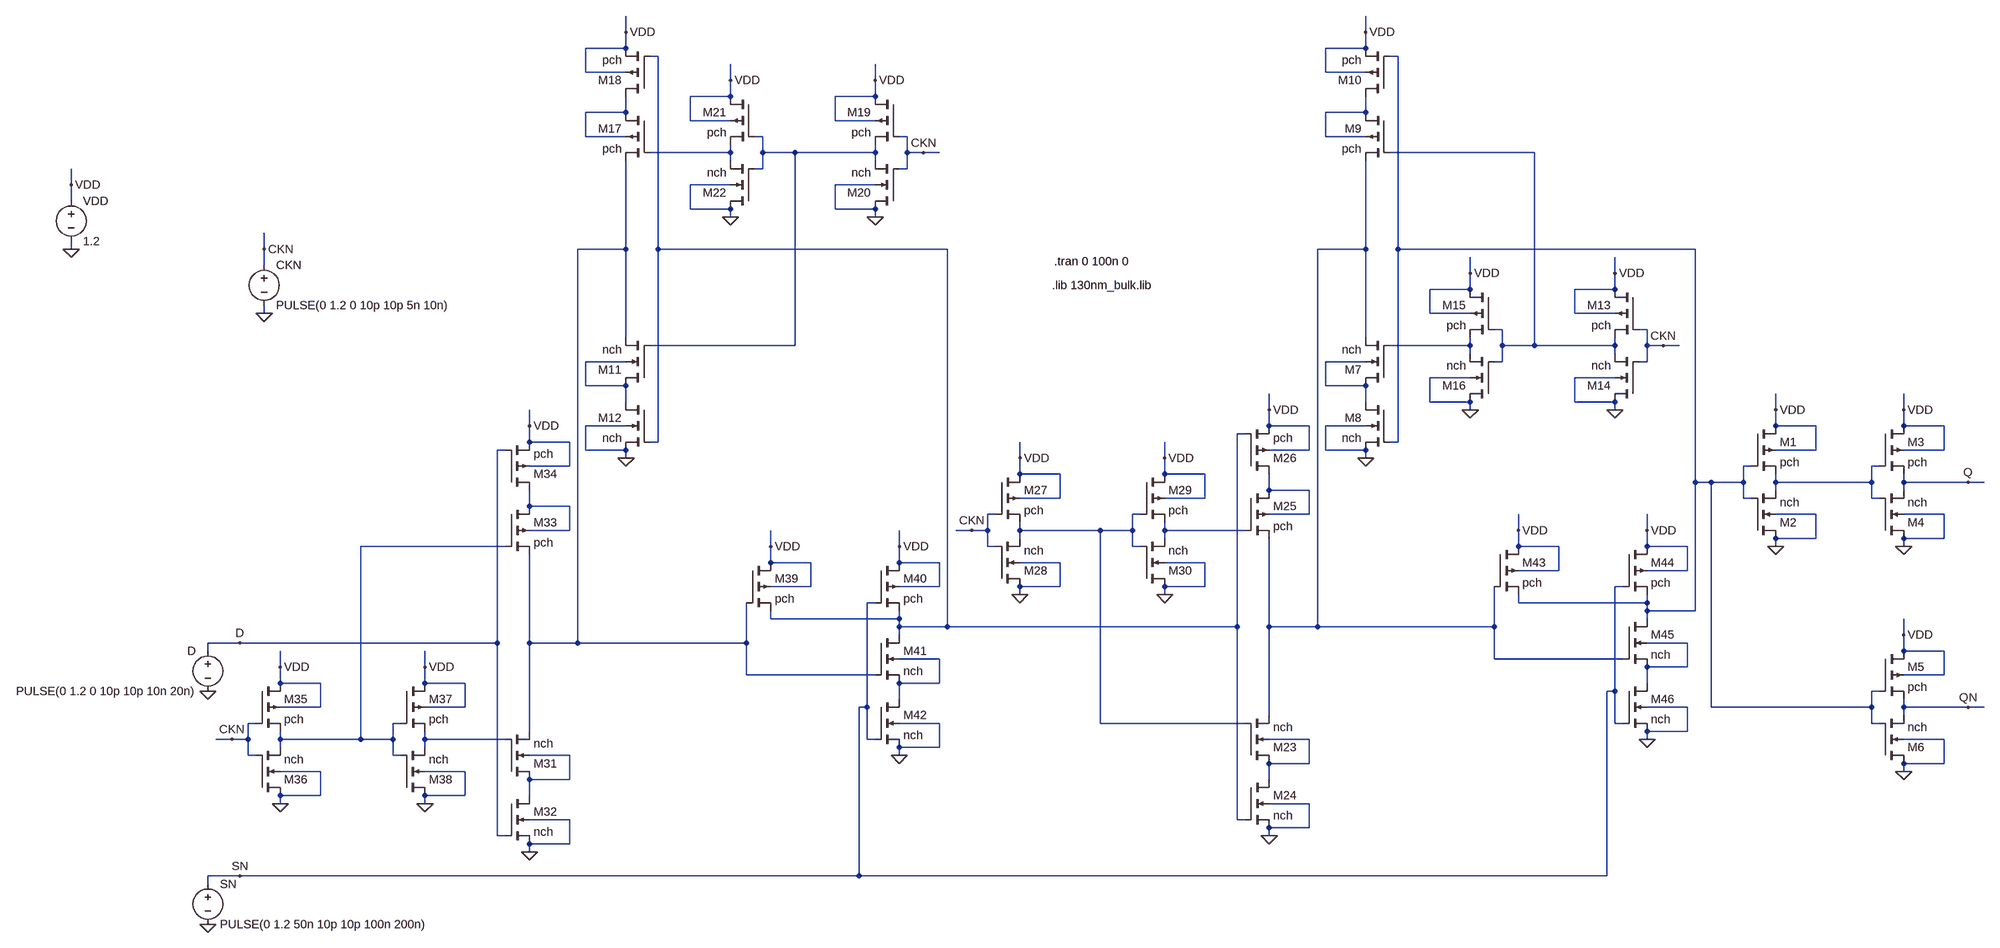
[diagram p0: schematic D_FLIPFLOP_With_Asynchronous_Set_in_130nm_Technology.asc]
D_FLIPFLOP_With_Asynchronous_Set_in_130nm_Technology.asc, the LTspice schematic file:
Version 4
SHEET 1 880 2004
WIRE -1952 -752 -1952 -784
WIRE -480 -752 -480 -784
WIRE -1952 -720 -1952 -752
WIRE -1952 -720 -2032 -720
WIRE -480 -720 -480 -752
WIRE -480 -720 -560 -720
WIRE -1888 -704 -1904 -704
WIRE -416 -704 -432 -704
WIRE -2032 -672 -2032 -720
WIRE -1952 -672 -2032 -672
WIRE -560 -672 -560 -720
WIRE -480 -672 -560 -672
WIRE -1744 -656 -1744 -688
WIRE -1456 -656 -1456 -688
WIRE -1744 -624 -1744 -656
WIRE -1744 -624 -1824 -624
WIRE -1456 -624 -1456 -656
WIRE -1456 -624 -1536 -624
WIRE -1952 -592 -1952 -624
WIRE -1952 -592 -2032 -592
WIRE -480 -592 -480 -624
WIRE -480 -592 -560 -592
WIRE -1824 -576 -1824 -624
WIRE -1744 -576 -1824 -576
WIRE -1536 -576 -1536 -624
WIRE -1456 -576 -1536 -576
WIRE -2032 -544 -2032 -592
WIRE -1952 -544 -2032 -544
WIRE -1680 -544 -1696 -544
WIRE -1392 -544 -1408 -544
WIRE -560 -544 -560 -592
WIRE -480 -544 -560 -544
WIRE -1744 -512 -1744 -528
WIRE -1744 -512 -1904 -512
WIRE -1680 -512 -1680 -544
WIRE -1616 -512 -1680 -512
WIRE -1456 -512 -1456 -528
WIRE -1456 -512 -1616 -512
WIRE -1392 -512 -1392 -544
WIRE -1360 -512 -1392 -512
WIRE -1328 -512 -1360 -512
WIRE -144 -512 -432 -512
WIRE -1744 -496 -1744 -512
WIRE -1456 -496 -1456 -512
WIRE -1680 -480 -1680 -512
WIRE -1680 -480 -1696 -480
WIRE -1392 -480 -1392 -512
WIRE -1392 -480 -1408 -480
WIRE -3056 -448 -3056 -480
WIRE -1744 -448 -1824 -448
WIRE -1456 -448 -1536 -448
WIRE -3056 -416 -3056 -448
WIRE -1824 -400 -1824 -448
WIRE -1744 -400 -1824 -400
WIRE -1536 -400 -1536 -448
WIRE -1456 -400 -1536 -400
WIRE -1744 -384 -1744 -400
WIRE -1456 -384 -1456 -400
WIRE -3056 -320 -3056 -336
WIRE -2672 -320 -2672 -352
WIRE -1952 -320 -1952 -496
WIRE -1952 -320 -2048 -320
WIRE -1888 -320 -1888 -704
WIRE -1312 -320 -1888 -320
WIRE -480 -320 -480 -496
WIRE -480 -320 -576 -320
WIRE -416 -320 -416 -704
WIRE 176 -320 -416 -320
WIRE -2672 -288 -2672 -320
WIRE -272 -272 -272 -304
WIRE 16 -272 16 -304
WIRE -272 -240 -272 -272
WIRE -272 -240 -352 -240
WIRE 16 -240 16 -272
WIRE 16 -240 -64 -240
WIRE -2672 -192 -2672 -208
WIRE -352 -192 -352 -240
WIRE -272 -192 -352 -192
WIRE -64 -192 -64 -240
WIRE 16 -192 -64 -192
WIRE -208 -160 -224 -160
WIRE 80 -160 64 -160
WIRE -1952 -144 -1952 -320
WIRE -480 -144 -480 -320
WIRE -1616 -128 -1616 -512
WIRE -1616 -128 -1904 -128
WIRE -272 -128 -272 -144
WIRE -272 -128 -432 -128
WIRE -208 -128 -208 -160
WIRE -144 -128 -144 -512
WIRE -144 -128 -208 -128
WIRE 16 -128 16 -144
WIRE 16 -128 -144 -128
WIRE 80 -128 80 -160
WIRE 112 -128 80 -128
WIRE 144 -128 112 -128
WIRE -272 -112 -272 -128
WIRE 16 -112 16 -128
WIRE -1952 -96 -2032 -96
WIRE -480 -96 -560 -96
WIRE -208 -96 -208 -128
WIRE -208 -96 -224 -96
WIRE 80 -96 80 -128
WIRE 80 -96 64 -96
WIRE -272 -64 -352 -64
WIRE 16 -64 -64 -64
WIRE -2032 -48 -2032 -96
WIRE -1952 -48 -2032 -48
WIRE -560 -48 -560 -96
WIRE -480 -48 -560 -48
WIRE -1952 -16 -1952 -48
WIRE -480 -16 -480 -48
WIRE -352 -16 -352 -64
WIRE -272 -16 -352 -16
WIRE -64 -16 -64 -64
WIRE 16 -16 -64 -16
WIRE -672 0 -672 -32
WIRE -272 0 -272 -16
WIRE 16 0 16 -16
WIRE 336 0 336 -32
WIRE 624 0 624 -32
WIRE -2144 32 -2144 0
WIRE -1952 32 -2032 32
WIRE -672 32 -672 0
WIRE -592 32 -672 32
WIRE -480 32 -560 32
WIRE 336 32 336 0
WIRE 416 32 336 32
WIRE 624 32 624 0
WIRE 704 32 624 32
WIRE -720 48 -736 48
WIRE -2144 64 -2144 32
WIRE -2064 64 -2144 64
WIRE -1888 64 -1888 -320
WIRE -1888 64 -1904 64
WIRE -416 64 -416 -320
WIRE -416 64 -432 64
WIRE -2192 80 -2208 80
WIRE -2032 80 -2032 32
WIRE -1952 80 -2032 80
WIRE -592 80 -592 32
WIRE -592 80 -672 80
WIRE -560 80 -560 32
WIRE -480 80 -560 80
WIRE 416 80 416 32
WIRE 416 80 336 80
WIRE 704 80 704 32
WIRE 704 80 624 80
WIRE -1952 96 -1952 80
WIRE -1168 96 -1168 64
WIRE -880 96 -880 64
WIRE -480 96 -480 80
WIRE -2064 112 -2064 64
WIRE -2064 112 -2144 112
WIRE 288 112 272 112
WIRE 576 112 560 112
WIRE -1168 128 -1168 96
WIRE -1088 128 -1168 128
WIRE -880 128 -880 96
WIRE -800 128 -880 128
WIRE 176 144 176 -320
WIRE 208 144 176 144
WIRE 272 144 272 112
WIRE 272 144 208 144
WIRE 336 144 336 128
WIRE 560 144 560 112
WIRE 560 144 336 144
WIRE 624 144 624 128
WIRE 752 144 624 144
WIRE 784 144 752 144
WIRE -672 160 -672 128
WIRE -592 160 -672 160
WIRE 336 160 336 144
WIRE 624 160 624 144
WIRE -1088 176 -1088 128
WIRE -1088 176 -1168 176
WIRE -800 176 -800 128
WIRE -800 176 -880 176
WIRE 272 176 272 144
WIRE 288 176 272 176
WIRE 560 176 560 144
WIRE 576 176 560 176
WIRE -2144 192 -2144 160
WIRE -2064 192 -2144 192
WIRE -1216 208 -1232 208
WIRE -928 208 -944 208
WIRE -592 208 -592 160
WIRE -592 208 -672 208
WIRE 416 208 336 208
WIRE 704 208 624 208
WIRE -2064 240 -2064 192
WIRE -2064 240 -2144 240
WIRE -1264 240 -1296 240
WIRE -1232 240 -1232 208
WIRE -1232 240 -1264 240
WIRE -1168 240 -1168 224
WIRE -1008 240 -1168 240
WIRE -944 240 -944 208
WIRE -944 240 -1008 240
WIRE -880 240 -880 224
WIRE -720 240 -880 240
WIRE -176 240 -176 208
WIRE 80 240 80 208
WIRE -1168 256 -1168 240
WIRE -880 256 -880 240
WIRE 416 256 416 208
WIRE 416 256 336 256
WIRE 704 256 704 208
WIRE 704 256 624 256
WIRE -2192 272 -2480 272
WIRE -1664 272 -1664 240
WIRE -1408 272 -1408 240
WIRE -1232 272 -1232 240
WIRE -1216 272 -1232 272
WIRE -944 272 -944 240
WIRE -928 272 -944 272
WIRE -176 272 -176 240
WIRE -96 272 -176 272
WIRE 80 272 80 240
WIRE 160 272 80 272
WIRE 336 272 336 256
WIRE 624 272 624 256
WIRE -1664 304 -1664 272
WIRE -1584 304 -1664 304
WIRE -1408 304 -1408 272
WIRE -1328 304 -1408 304
WIRE -1088 304 -1168 304
WIRE -800 304 -880 304
WIRE -96 320 -96 272
WIRE -96 320 -176 320
WIRE 160 320 160 272
WIRE 160 320 80 320
WIRE -1584 352 -1584 304
WIRE -1584 352 -1664 352
WIRE -1328 352 -1328 304
WIRE -1328 352 -1408 352
WIRE -1088 352 -1088 304
WIRE -1088 352 -1168 352
WIRE -800 352 -800 304
WIRE -800 352 -880 352
WIRE 32 352 16 352
WIRE -1168 368 -1168 352
WIRE -880 368 -880 352
WIRE -1456 384 -1472 384
WIRE -176 384 -176 368
WIRE 80 384 80 368
WIRE 80 384 -176 384
WIRE 80 400 80 384
WIRE 176 400 176 144
WIRE 176 400 80 400
WIRE -1664 416 -1664 400
WIRE -1408 416 -1408 400
WIRE -1408 416 -1664 416
WIRE 80 416 80 400
WIRE -1408 432 -1408 416
WIRE -1312 432 -1312 -320
WIRE -1312 432 -1408 432
WIRE -736 432 -736 48
WIRE -736 432 -1312 432
WIRE -672 432 -672 256
WIRE -576 432 -576 -320
WIRE -576 432 -672 432
WIRE -224 432 -224 352
WIRE -224 432 -576 432
WIRE -1408 448 -1408 432
WIRE 624 448 624 416
WIRE -2720 464 -2784 464
WIRE -2208 464 -2208 80
WIRE -2208 464 -2720 464
WIRE -2144 464 -2144 288
WIRE -2048 464 -2048 -320
WIRE -2048 464 -2144 464
WIRE -1712 464 -1712 384
WIRE -1712 464 -2048 464
WIRE 160 464 80 464
WIRE -2784 480 -2784 464
WIRE 624 480 624 448
WIRE 704 480 624 480
WIRE -1328 496 -1408 496
WIRE -224 496 -224 432
WIRE 32 496 -224 496
WIRE -2640 512 -2640 480
WIRE -2352 512 -2352 480
WIRE 160 512 160 464
WIRE 160 512 80 512
WIRE -1712 528 -1712 464
WIRE -1456 528 -1712 528
WIRE 704 528 704 480
WIRE 704 528 624 528
WIRE -2640 544 -2640 512
WIRE -2560 544 -2640 544
WIRE -2352 544 -2352 512
WIRE -2272 544 -2352 544
WIRE -1328 544 -1328 496
WIRE -1328 544 -1408 544
WIRE 80 544 80 512
WIRE 16 560 16 352
WIRE 16 560 0 560
WIRE 576 560 560 560
WIRE -1408 576 -1408 544
WIRE -2560 592 -2560 544
WIRE -2560 592 -2640 592
WIRE -2272 592 -2272 544
WIRE -2272 592 -2352 592
WIRE -1472 592 -1472 384
WIRE -1472 592 -1488 592
WIRE 160 592 80 592
WIRE 208 592 208 144
WIRE 560 592 560 560
WIRE 560 592 208 592
WIRE 624 592 624 576
WIRE 752 592 624 592
WIRE 784 592 752 592
WIRE -672 608 -672 432
WIRE 624 608 624 592
WIRE -2688 624 -2704 624
WIRE -2400 624 -2416 624
WIRE -1328 624 -1408 624
WIRE -1008 624 -1008 240
WIRE -720 624 -1008 624
WIRE 16 624 16 560
WIRE 32 624 16 624
WIRE 560 624 560 592
WIRE 576 624 560 624
WIRE -2144 640 -2144 464
WIRE 160 640 160 592
WIRE 160 640 80 640
WIRE -2736 656 -2768 656
WIRE -2704 656 -2704 624
WIRE -2704 656 -2736 656
WIRE -2640 656 -2640 640
WIRE -2480 656 -2480 272
WIRE -2480 656 -2640 656
WIRE -2416 656 -2416 624
WIRE -2416 656 -2480 656
WIRE -2352 656 -2352 640
WIRE -2192 656 -2352 656
WIRE -1472 656 -1472 592
WIRE -1456 656 -1472 656
WIRE -592 656 -672 656
WIRE 80 656 80 640
WIRE 704 656 624 656
WIRE -2640 672 -2640 656
WIRE -2352 672 -2352 656
WIRE -1328 672 -1328 624
WIRE -1328 672 -1408 672
WIRE -2704 688 -2704 656
WIRE -2688 688 -2704 688
WIRE -2416 688 -2416 656
WIRE -2400 688 -2416 688
WIRE -2064 688 -2144 688
WIRE -1408 688 -1408 672
WIRE -592 704 -592 656
WIRE -592 704 -672 704
WIRE 704 704 704 656
WIRE 704 704 624 704
WIRE -2560 720 -2640 720
WIRE -2272 720 -2352 720
WIRE 624 720 624 704
WIRE -2064 736 -2064 688
WIRE -2064 736 -2144 736
WIRE -672 736 -672 704
WIRE -2560 768 -2560 720
WIRE -2560 768 -2640 768
WIRE -2272 768 -2272 720
WIRE -2272 768 -2352 768
WIRE -2144 768 -2144 736
WIRE -2640 784 -2640 768
WIRE -2352 784 -2352 768
WIRE -592 784 -672 784
WIRE -2064 816 -2144 816
WIRE -736 816 -736 432
WIRE -720 816 -736 816
WIRE -592 832 -592 784
WIRE -592 832 -672 832
WIRE -2208 848 -2208 464
WIRE -2192 848 -2208 848
WIRE -672 848 -672 832
WIRE -2064 864 -2064 816
WIRE -2064 864 -2144 864
WIRE -2144 880 -2144 864
WIRE -2720 928 -2784 928
WIRE -1488 928 -1488 592
WIRE -1488 928 -2720 928
WIRE 0 928 0 560
WIRE 0 928 -1488 928
WIRE -2784 944 -2784 928
FLAG -2640 784 0
FLAG -2352 784 0
FLAG -1408 688 0
FLAG -2144 32 VDD
FLAG -2736 656 CKN
FLAG -1168 368 0
FLAG -880 368 0
FLAG -672 0 VDD
FLAG -1264 240 CKN
FLAG -1168 96 VDD
FLAG -880 96 VDD
FLAG -1456 -384 0
FLAG -1744 -384 0
FLAG -1952 -752 VDD
FLAG -1360 -512 CKN
FLAG -1456 -656 VDD
FLAG -1744 -656 VDD
FLAG 16 0 0
FLAG -272 0 0
FLAG -480 -752 VDD
FLAG 112 -128 CKN
FLAG 80 656 0
FLAG -2144 880 0
FLAG -1952 96 0
FLAG -672 848 0
FLAG -480 96 0
FLAG 336 272 0
FLAG 624 272 0
FLAG 624 720 0
FLAG -2352 512 VDD
FLAG -2640 512 VDD
FLAG -1664 272 VDD
FLAG -1408 272 VDD
FLAG -272 -272 VDD
FLAG 16 -272 VDD
FLAG -176 240 VDD
FLAG 80 240 VDD
FLAG 336 0 VDD
FLAG 624 0 VDD
FLAG 624 448 VDD
FLAG -2720 464 D
FLAG -2720 928 SN
FLAG 752 144 Q
FLAG 752 592 QN
FLAG -3056 -320 0
FLAG -3056 -448 VDD
FLAG -2784 560 0
FLAG -2784 1024 0
FLAG -2672 -192 0
FLAG -2672 -320 CKN
SYMBOL pmos4 288 32 R0
SYMATTR InstName M1
SYMATTR Value pch
SYMATTR Value2 l=0.13u w=0.8u
SYMBOL nmos4 288 256 M180
SYMATTR InstName M2
SYMATTR Value nch
SYMATTR Value2 l=0.13u w=0.4u
SYMBOL pmos4 576 32 R0
SYMATTR InstName M3
SYMATTR Value pch
SYMATTR Value2 l=0.13u w=0.8u
SYMBOL nmos4 576 256 M180
SYMATTR InstName M4
SYMATTR Value nch
SYMATTR Value2 l=0.13u w=0.4u
SYMBOL pmos4 576 480 R0
SYMATTR InstName M5
SYMATTR Value pch
SYMATTR Value2 l=0.13u w=0.8u
SYMBOL nmos4 576 704 M180
SYMATTR InstName M6
SYMATTR Value nch
SYMATTR Value2 l=0.13u w=0.4u
SYMBOL nmos4 -2192 736 M180
SYMATTR InstName M31
SYMATTR Value nch
SYMATTR Value2 l=0.13u w=0.4u
SYMBOL nmos4 -2192 768 R0
SYMATTR InstName M32
SYMATTR Value nch
SYMATTR Value2 l=0.13u w=0.4u
SYMBOL pmos4 -2192 192 R0
SYMATTR InstName M33
SYMATTR Value pch
SYMATTR Value2 l=0.13u w=0.8u
SYMBOL pmos4 -2192 160 M180
SYMATTR InstName M34
SYMATTR Value pch
SYMATTR Value2 l=0.13u w=0.8u
SYMBOL pmos4 -2688 544 R0
SYMATTR InstName M35
SYMATTR Value pch
SYMATTR Value2 l=0.13u w=0.8u
SYMBOL nmos4 -2688 768 M180
SYMATTR InstName M36
SYMATTR Value nch
SYMATTR Value2 l=0.13u w=0.4u
SYMBOL pmos4 -2400 544 R0
SYMATTR InstName M37
SYMATTR Value pch
SYMATTR Value2 l=0.13u w=0.8u
SYMBOL nmos4 -2400 768 M180
SYMATTR InstName M38
SYMATTR Value nch
SYMATTR Value2 l=0.13u w=0.4u
SYMBOL pmos4 -1712 304 R0
SYMATTR InstName M39
SYMATTR Value pch
SYMATTR Value2 l=0.13u w=0.8u
SYMBOL pmos4 -1456 304 R0
SYMATTR InstName M40
SYMATTR Value pch
SYMATTR Value2 l=0.13u w=0.8u
SYMBOL nmos4 -1456 448 R0
SYMATTR InstName M41
SYMATTR Value nch
SYMATTR Value2 l=0.13u w=0.8u
SYMBOL nmos4 -1456 576 R0
SYMATTR InstName M42
SYMATTR Value nch
SYMATTR Value2 l=0.13u w=0.8u
SYMBOL pmos4 -224 272 R0
SYMATTR InstName M43
SYMATTR Value pch
SYMATTR Value2 l=0.13u w=0.8u
SYMBOL pmos4 32 272 R0
SYMATTR InstName M44
SYMATTR Value pch
SYMATTR Value2 l=0.13u w=0.8u
SYMBOL nmos4 32 416 R0
SYMATTR InstName M45
SYMATTR Value nch
SYMATTR Value2 l=0.13u w=0.8u
SYMBOL nmos4 32 544 R0
SYMATTR InstName M46
SYMATTR Value nch
SYMATTR Value2 l=0.13u w=0.8u
SYMBOL nmos4 -720 704 M180
SYMATTR InstName M23
SYMATTR Value nch
SYMATTR Value2 l=0.13u w=0.4u
SYMBOL nmos4 -720 736 R0
SYMATTR InstName M24
SYMATTR Value nch
SYMATTR Value2 l=0.13u w=0.4u
SYMBOL pmos4 -720 160 R0
SYMATTR InstName M25
SYMATTR Value pch
SYMATTR Value2 l=0.13u w=0.8u
SYMBOL pmos4 -720 128 M180
SYMATTR InstName M26
SYMATTR Value pch
SYMATTR Value2 l=0.13u w=0.8u
SYMBOL pmos4 -1216 128 R0
SYMATTR InstName M27
SYMATTR Value pch
SYMATTR Value2 l=0.13u w=0.8u
SYMBOL nmos4 -1216 352 M180
SYMATTR InstName M28
SYMATTR Value nch
SYMATTR Value2 l=0.13u w=0.4u
SYMBOL pmos4 -928 128 R0
SYMATTR InstName M29
SYMATTR Value pch
SYMATTR Value2 l=0.13u w=0.8u
SYMBOL nmos4 -928 352 M180
SYMATTR InstName M30
SYMATTR Value nch
SYMATTR Value2 l=0.13u w=0.4u
SYMBOL nmos4 -1904 -48 R180
SYMATTR InstName M11
SYMATTR Value nch
SYMATTR Value2 l=0.13u w=0.4u
SYMBOL nmos4 -1904 -16 M0
SYMATTR InstName M12
SYMATTR Value nch
SYMATTR Value2 l=0.13u w=0.4u
SYMBOL pmos4 -1904 -592 M0
SYMATTR InstName M17
SYMATTR Value pch
SYMATTR Value2 l=0.13u w=0.8u
SYMBOL pmos4 -1904 -624 R180
SYMATTR InstName M18
SYMATTR Value pch
SYMATTR Value2 l=0.13u w=0.8u
SYMBOL pmos4 -1408 -624 M0
SYMATTR InstName M19
SYMATTR Value pch
SYMATTR Value2 l=0.13u w=0.8u
SYMBOL nmos4 -1408 -400 R180
SYMATTR InstName M20
SYMATTR Value nch
SYMATTR Value2 l=0.13u w=0.4u
SYMBOL pmos4 -1696 -624 M0
SYMATTR InstName M21
SYMATTR Value pch
SYMATTR Value2 l=0.13u w=0.8u
SYMBOL nmos4 -1696 -400 R180
SYMATTR InstName M22
SYMATTR Value nch
SYMATTR Value2 l=0.13u w=0.4u
SYMBOL nmos4 -432 -48 R180
SYMATTR InstName M7
SYMATTR Value nch
SYMATTR Value2 l=0.13u w=0.4u
SYMBOL nmos4 -432 -16 M0
SYMATTR InstName M8
SYMATTR Value nch
SYMATTR Value2 l=0.13u w=0.4u
SYMBOL pmos4 -432 -592 M0
SYMATTR InstName M9
SYMATTR Value pch
SYMATTR Value2 l=0.13u w=0.8u
SYMBOL pmos4 -432 -624 R180
SYMATTR InstName M10
SYMATTR Value pch
SYMATTR Value2 l=0.13u w=0.8u
SYMBOL pmos4 64 -240 M0
SYMATTR InstName M13
SYMATTR Value pch
SYMATTR Value2 l=0.13u w=0.8u
SYMBOL nmos4 64 -16 R180
SYMATTR InstName M14
SYMATTR Value nch
SYMATTR Value2 l=0.13u w=0.4u
SYMBOL pmos4 -224 -240 M0
SYMATTR InstName M15
SYMATTR Value pch
SYMATTR Value2 l=0.13u w=0.8u
SYMBOL nmos4 -224 -16 R180
SYMATTR InstName M16
SYMATTR Value nch
SYMATTR Value2 l=0.13u w=0.4u
SYMBOL voltage -3056 -432 R0
WINDOW 123 0 0 Left 0
WINDOW 39 0 0 Left 0
SYMATTR InstName VDD
SYMATTR Value 1.2
SYMBOL voltage -2784 464 M0
WINDOW 123 24 124 Left 2
WINDOW 39 0 0 Left 0
SYMATTR InstName D
SYMATTR Value PULSE(0 1.2 0 10p 10p 10n 20n)
SYMBOL voltage -2784 928 R0
WINDOW 123 0 0 Left 0
WINDOW 39 0 0 Left 0
SYMATTR InstName SN
SYMATTR Value PULSE(0 1.2 50n 10p 10p 100n 200n)
SYMBOL voltage -2672 -304 R0
WINDOW 123 0 0 Left 0
WINDOW 39 0 0 Left 0
SYMATTR InstName CKN
SYMATTR Value PULSE(0 1.2 0 10p 10p 5n 10n)
TEXT -1104 -248 Left 2 !.lib 130nm_bulk.lib
TEXT -1100 -296 Left 2 !.tran 0 100n 0

The netlist it stands for:
* D_FLIPFLOP_With_Asynchronous_Set_in_130nm_Technology.asc
M1 VDD N002 N013 VDD pch l=0.13u w=0.8u
M2 0 N002 N013 0 nch l=0.13u w=0.4u
M3 VDD N013 Q VDD pch l=0.13u w=0.8u
M4 0 N013 Q 0 nch l=0.13u w=0.4u
M5 VDD N002 QN VDD pch l=0.13u w=0.8u
M6 0 N002 QN 0 nch l=0.13u w=0.4u
M31 N023 N021 N008 N023 nch l=0.13u w=0.4u
M32 N023 D 0 0 nch l=0.13u w=0.4u
M33 N015 N018 N008 N015 pch l=0.13u w=0.8u
M34 N015 D VDD VDD pch l=0.13u w=0.8u
M35 VDD CKN N018 VDD pch l=0.13u w=0.8u
M36 0 CKN N018 0 nch l=0.13u w=0.4u
M37 VDD N018 N021 VDD pch l=0.13u w=0.8u
M38 0 N018 N021 0 nch l=0.13u w=0.4u
M39 VDD N008 N001 VDD pch l=0.13u w=0.8u
M40 VDD SN N001 VDD pch l=0.13u w=0.8u
M41 N001 N008 N020 N020 nch l=0.13u w=0.8u
M42 N020 SN 0 0 nch l=0.13u w=0.8u
M43 VDD N009 N002 VDD pch l=0.13u w=0.8u
M44 VDD SN N002 VDD pch l=0.13u w=0.8u
M45 N002 N009 N019 N019 nch l=0.13u w=0.8u
M46 N019 SN 0 0 nch l=0.13u w=0.8u
M23 N022 N016 N009 N022 nch l=0.13u w=0.4u
M24 N022 N001 0 0 nch l=0.13u w=0.4u
M25 N014 N017 N009 N014 pch l=0.13u w=0.8u
M26 N014 N001 VDD VDD pch l=0.13u w=0.8u
M27 VDD CKN N016 VDD pch l=0.13u w=0.8u
M28 0 CKN N016 0 nch l=0.13u w=0.4u
M29 VDD N016 N017 VDD pch l=0.13u w=0.8u
M30 0 N016 N017 0 nch l=0.13u w=0.4u
M11 N011 N005 N008 N011 nch l=0.13u w=0.4u
M12 N011 N001 0 0 nch l=0.13u w=0.4u
M17 N003 N006 N008 N003 pch l=0.13u w=0.8u
M18 N003 N001 VDD VDD pch l=0.13u w=0.8u
M19 VDD CKN N005 VDD pch l=0.13u w=0.8u
M20 0 CKN N005 0 nch l=0.13u w=0.4u
M21 VDD N005 N006 VDD pch l=0.13u w=0.8u
M22 0 N005 N006 0 nch l=0.13u w=0.4u
M7 N012 N010 N009 N012 nch l=0.13u w=0.4u
M8 N012 N002 0 0 nch l=0.13u w=0.4u
M9 N004 N007 N009 N004 pch l=0.13u w=0.8u
M10 N004 N002 VDD VDD pch l=0.13u w=0.8u
M13 VDD CKN N007 VDD pch l=0.13u w=0.8u
M14 0 CKN N007 0 nch l=0.13u w=0.4u
M15 VDD N007 N010 VDD pch l=0.13u w=0.8u
M16 0 N007 N010 0 nch l=0.13u w=0.4u
VDD VDD 0 1.2
V§D D 0 PULSE(0 1.2 0 10p 10p 10n 20n)
V§SN SN 0 PULSE(0 1.2 50n 10p 10p 100n 200n)
V§CKN CKN 0 PULSE(0 1.2 0 10p 10p 5n 10n)
.model NMOS NMOS
.model PMOS PMOS
.lib standard.mos
.lib 130nm_bulk.lib
.tran 0 100n 0
.backanno
.end